# EAGLE design RGB_controller_2zone_v2.00_with_Ard_Nano (EAGLE 8.1.0)
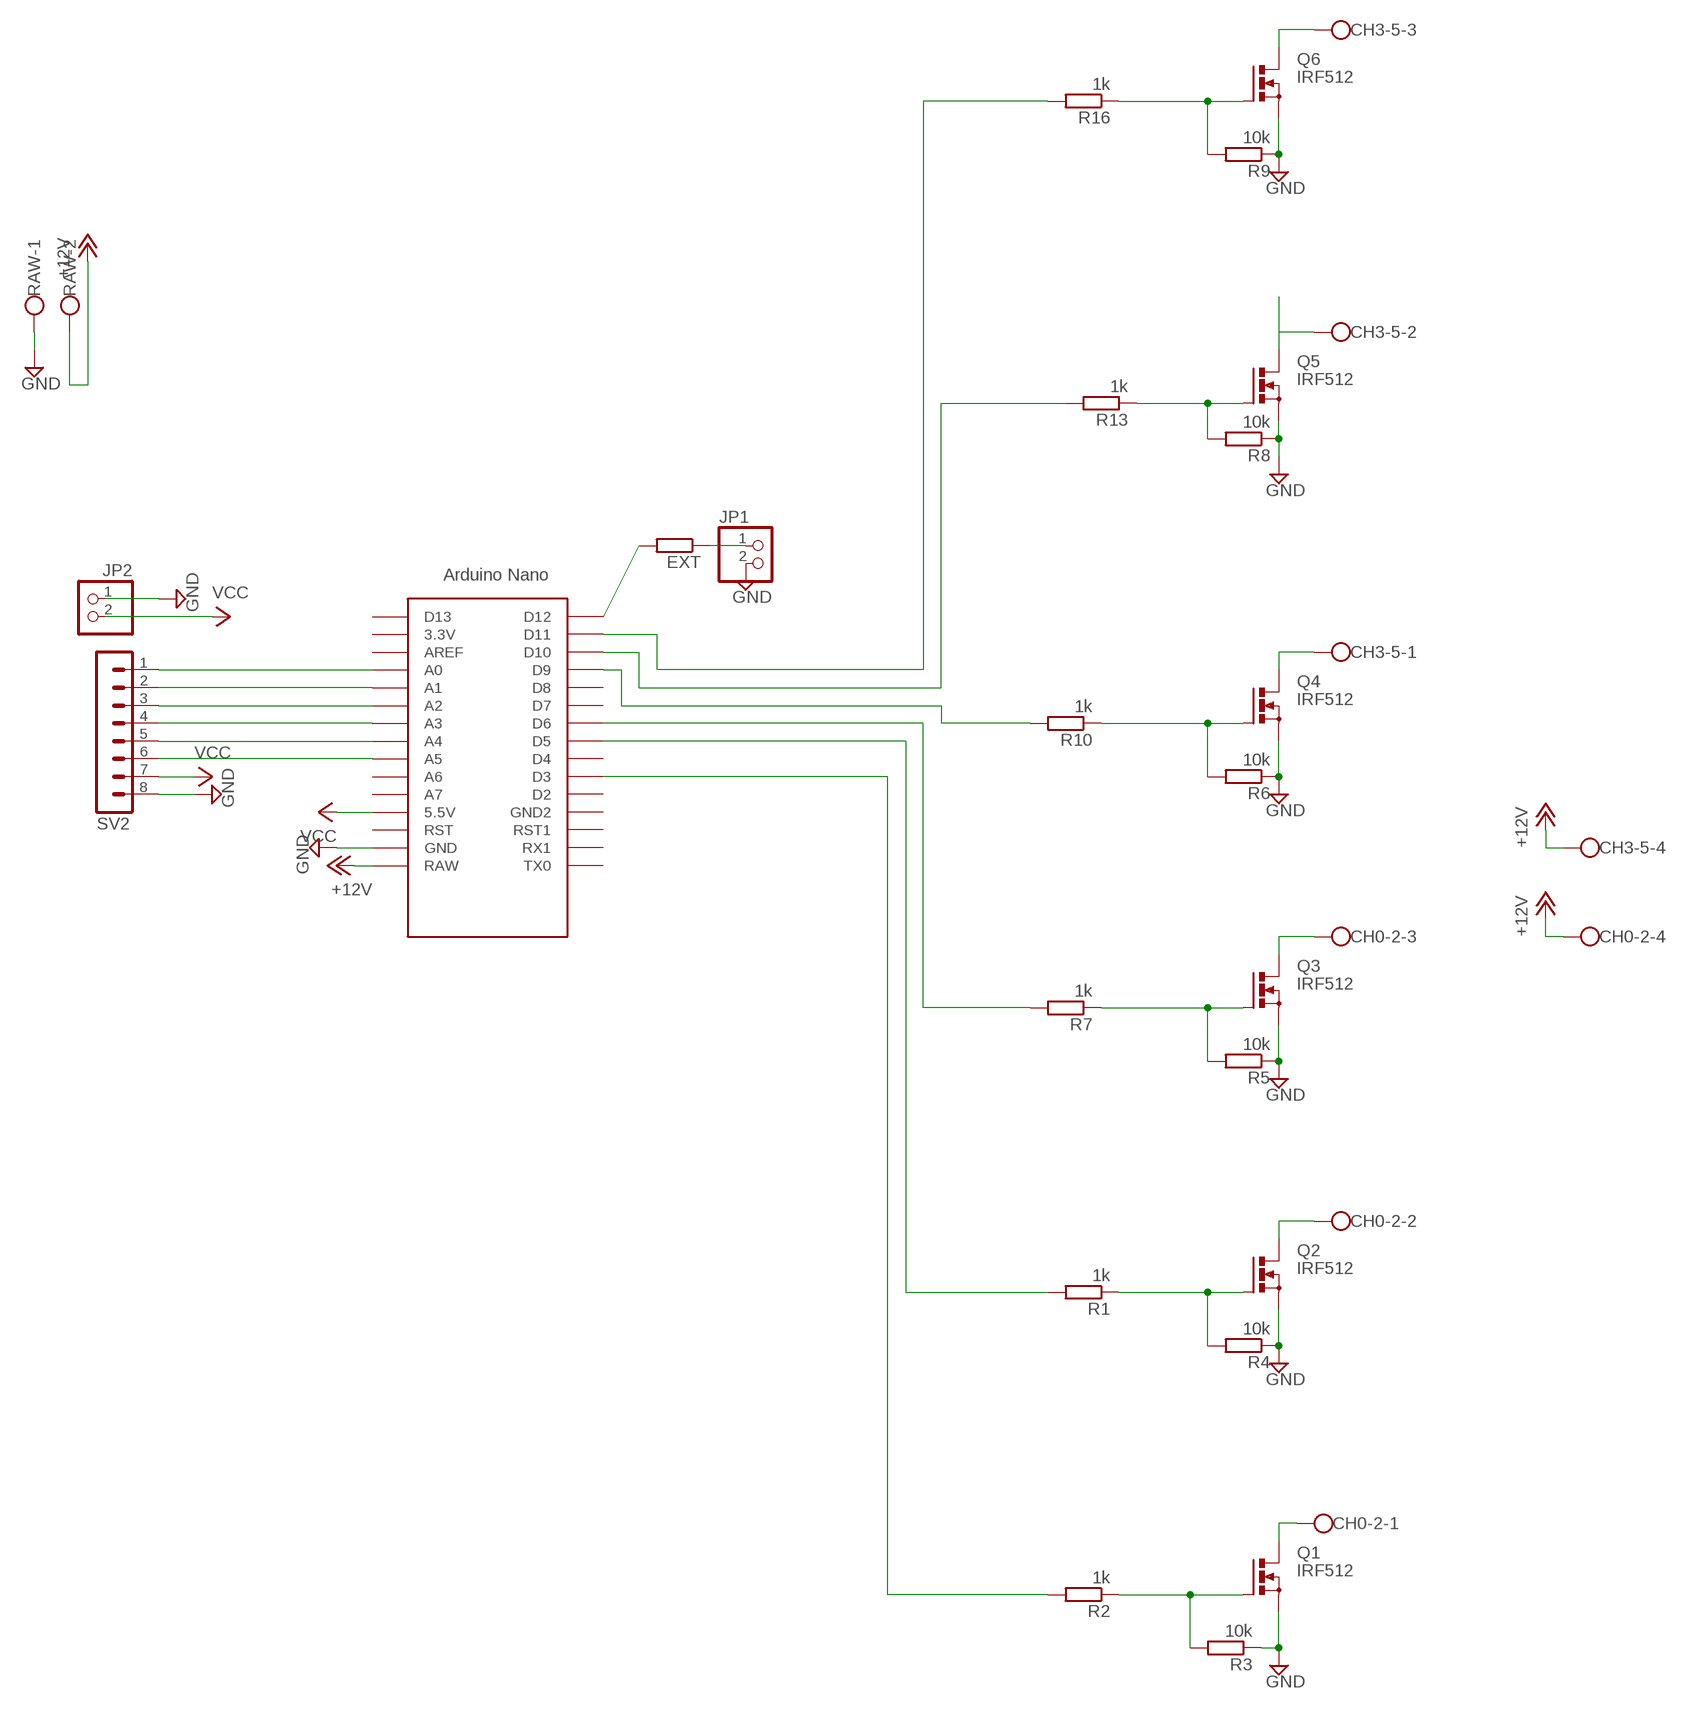
[diagram p0: schematic, sheet 1]

## Parts
CH0-2  W237-4  [W237-4]
CH3-5  W237-4  [W237-4]
EXT  R-EU_0207/10  [0207/10]
JP1  PINHD-1X2  [1X02]
JP2  PINHD-1X2  [1X02]
Q1  IRF512  [TO220BV]
Q2  IRF512  [TO220BV]
Q3  IRF512  [TO220BV]
Q4  IRF512  [TO220BV]
Q5  IRF512  [TO220BV]
Q6  IRF512  [TO220BV]
R1  1k  R-EU_0207/10  [0207/10]
R2  1k  R-EU_0207/10  [0207/10]
R3  10k  R-EU_0207/10  [0207/10]
R4  10k  R-EU_0207/10  [0207/10]
R5  10k  R-EU_0207/10  [0207/10]
R6  10k  R-EU_0207/10  [0207/10]
R7  1k  R-EU_0207/10  [0207/10]
R8  10k  R-EU_0207/10  [0207/10]
R9  10k  R-EU_0207/10  [0207/10]
R10  1k  R-EU_0207/10  [0207/10]
R13  1k  R-EU_0207/10  [0207/10]
R16  1k  R-EU_0207/10  [0207/10]
RAW  W237-102  [W237-102]
SV2  MA08-1  [MA08-1]
U$1  NANO  [NANO]

## Nets
+12V: CH0-2.4 CH3-5.4 RAW.2 U$1.RAW
A0: SV2.1 U$1.A0
A1: SV2.2 U$1.A1
A2: SV2.3 U$1.A2
A3: SV2.4 U$1.A3
A4-D18: SV2.5 U$1.A4
A4-D19: SV2.6 U$1.A5
D12: EXT.2 U$1.D12
GATE_1: Q1.G R2.1 R3.2
GATE_2: Q2.G R1.1 R4.2
GATE_3: Q3.G R5.2 R7.1
GATE_4: Q4.G R6.2 R10.1
GATE_5: Q5.G R8.2 R13.1
GATE_6: Q6.G R9.2 R16.1
GND: JP1.2 JP2.1 Q1.S Q2.S Q3.S Q4.S Q5.S Q6.S R3.1 R4.1 R5.1 R6.1 R8.1 R9.1 RAW.1 SV2.8 U$1.GND
IC_PWM_OUT_0: R2.2 U$1.D3
IC_PWM_OUT_1: R1.2 U$1.D5
IC_PWM_OUT_2: R7.2 U$1.D6
IC_PWM_OUT_3: R10.2 U$1.D9
IC_PWM_OUT_4: R13.2 U$1.D10
IC_PWM_OUT_5: R16.2 U$1.D11
N$2: EXT.1 JP1.1
OUTPUT_0: CH0-2.1 Q1.D
OUTPUT_1: CH0-2.2 Q2.D
OUTPUT_2: CH0-2.3 Q3.D
OUTPUT_3: CH3-5.1 Q4.D
OUTPUT_4: CH3-5.2 Q5.D
OUTPUT_5: CH3-5.3 Q6.D
VCC: JP2.2 SV2.7 U$1.5V(5.5V)
Unconnected: U$1.3.3V U$1.A6 U$1.A7 U$1.AREF U$1.D2 U$1.D4 U$1.D7 U$1.D8 U$1.D13 U$1.GND1(GND2) U$1.ICSP1 U$1.ICSP2 U$1.ICSP3 U$1.ICSP4 U$1.ICSP5 U$1.ICSP6 U$1.RST U$1.RST1 U$1.RX1 U$1.TX0

## Library data of the parts
CH0-2 CH3-5 = con-wago-500:W237-4: WAGO SCREW CLAMP; OC_FARNELL: unknown; OC_NEWARK: unknown
EXT R1-R10 R13 R16 = rcl:R-EU_: RESISTOR, European symbol
JP1 JP2 = pinhead:PINHD-1X2: PIN HEADER
Q1-Q6 = transistor-power:IRF512: N-CHANNEL MOS FET
RAW = con-wago-500:W237-102: WAGO SCREW CLAMP; MPN: 237-102; OC_FARNELL: unknown; OC_NEWARK: 70K9898
SV2 = con-lstb:MA08-1: PIN HEADER; OC_FARNELL: unknown; OC_NEWARK: unknown
U$1 = Arduino-clone:NANO: Arduino Nano

## Board
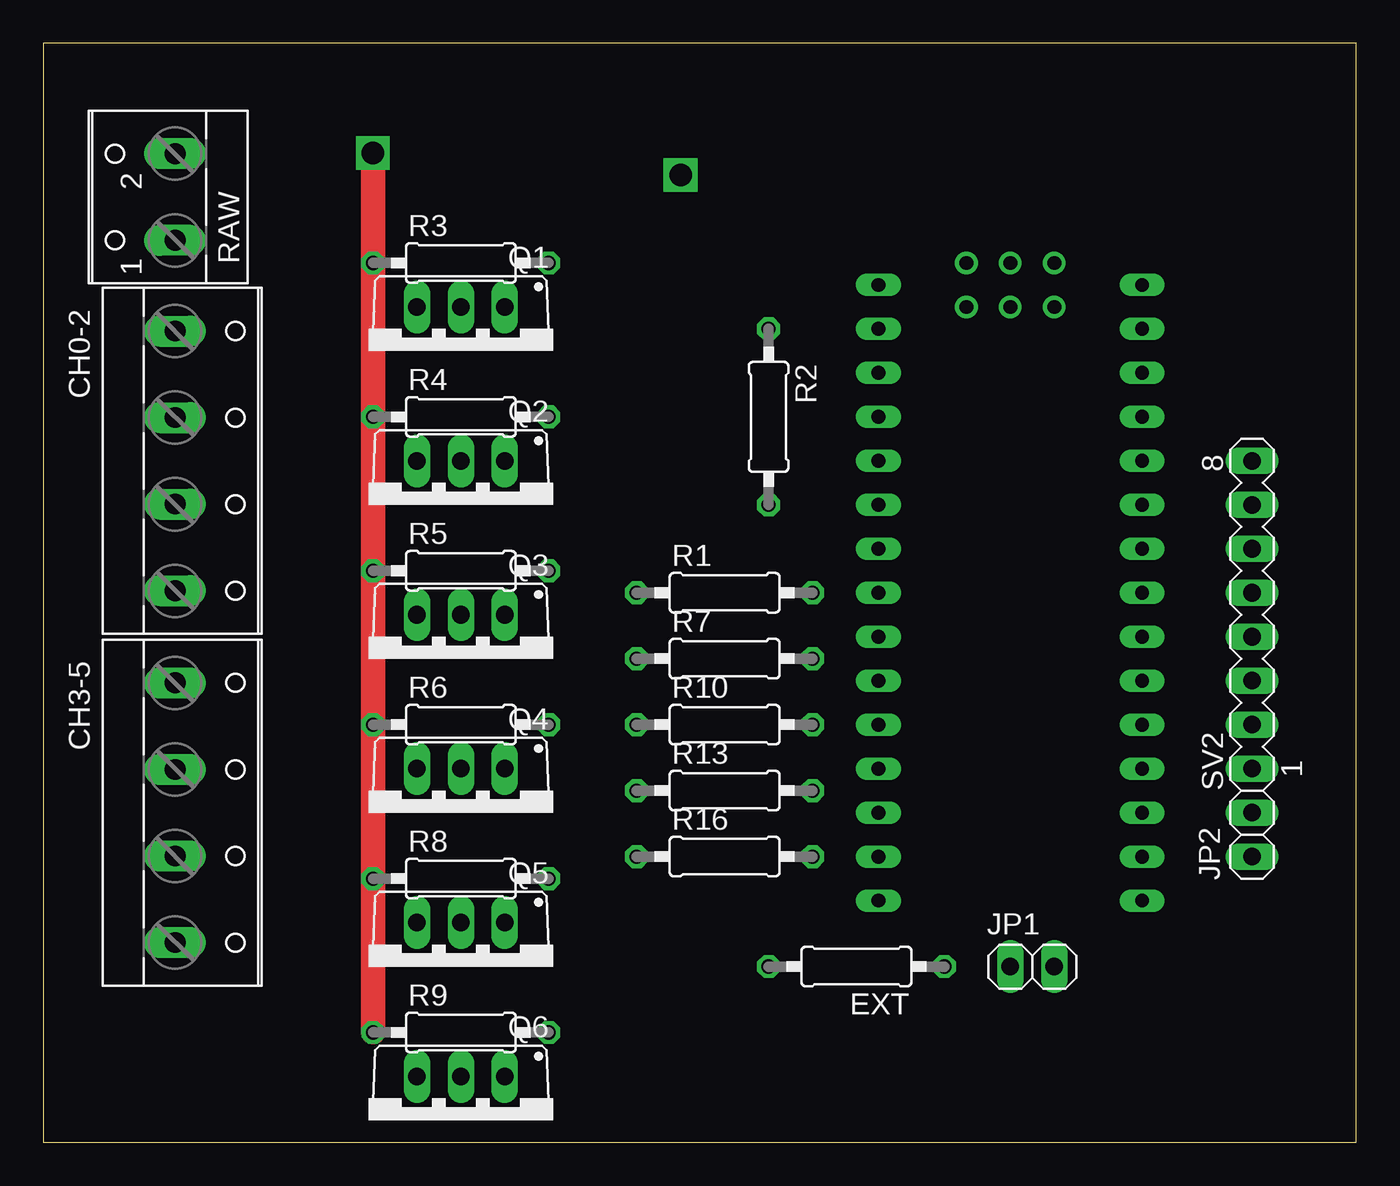
[diagram p1: board, top side]
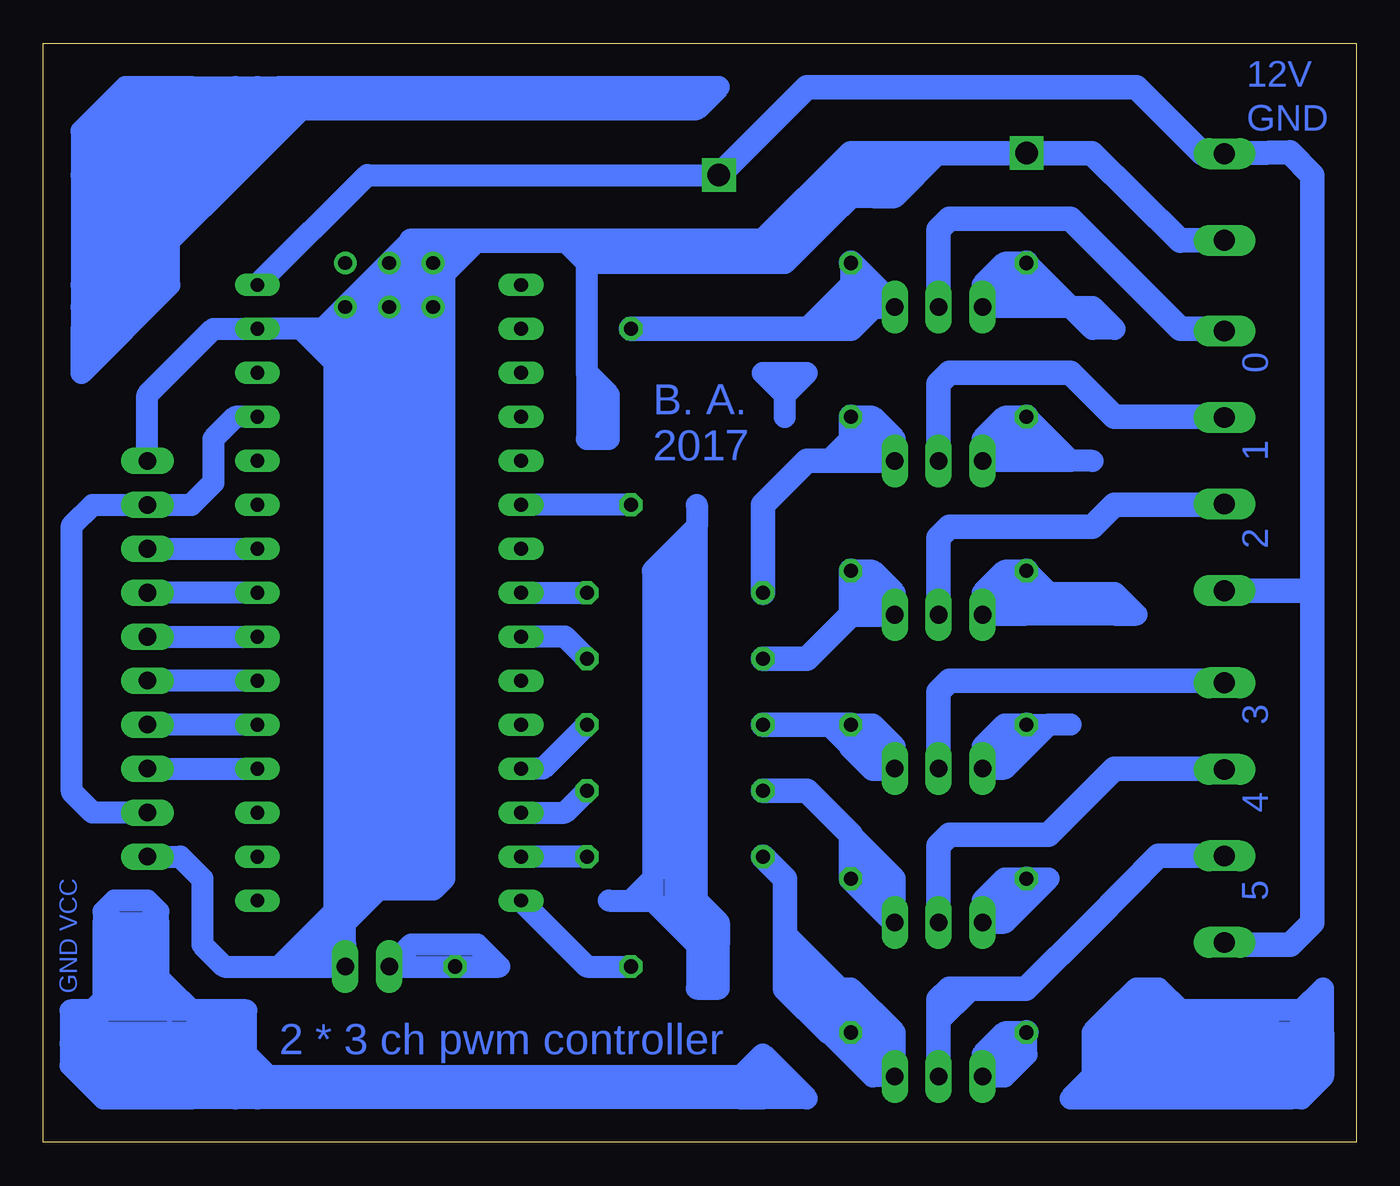
[diagram p2: board, bottom side, seen from below]

Size 75.87 x 63.49 mm. Coordinates in mm from the lower left corner, seen from the top.
Outline: 0,0 75.87,0 75.87,63.49 0,63.49 0,0
Copper layers (1*16): Top 0.035mm / dielectric 1.5mm / Bottom 0.035mm
Design rules "default": minimum track width 10mil, minimum drill 24mil, track to track 8mil, track to pad 8mil, pad to pad 8mil, via to via 8mil, smd to smd 8mil, copper to edge 40mil, drill to drill 8mil, minimum pad ring 10mil, minimum via ring 8mil, stop-mask expansion 4mil, vias tented up to drill 0mil, thermal gap 10mil

### Footprints (pad centres in the part's own frame; a part is rotated, then mirrored left to right if it is on the bottom)
W237-4 = drill 1.194 long: 1 -7.5,-1.27; 2 -2.5,-1.27; 3 2.5,-1.27; 4 7.5,-1.27
0207/10 = drill 0.813 octagon: 1 -5.08,0; 2 5.08,0
1X02 = drill 1.016 long: 1 -1.27,0; 2 1.27,0
TO220BV = drill 1.016 long: D 0,-2.54; G -2.54,-2.54; S 2.54,-2.54
W237-102 = drill 1.194 long: 1 -2.5,-1.27; 2 2.5,-1.27
MA08-1 = drill 1.016 long: 1 -8.89,0; 2 -6.35,0; 3 -3.81,0; 4 -1.27,0; 5 1.27,0; 6 3.81,0; 7 6.35,0; 8 8.89,0
NANO = drill 0.8 long: 3.3V -10.16,24.13; 5V -10.16,-1.27; A0 -10.16,19.05; A1 -10.16,16.51; A2 -10.16,13.97; A3 -10.16,11.43; A4 -10.16,8.89; A5 -10.16,6.35; A6 -10.16,3.81; A7 -10.16,1.27; AREF -10.16,21.59; D2 5.08,1.27; D3 5.08,3.81; D4 5.08,6.35; D5 5.08,8.89; D6 5.08,11.43; D7 5.08,13.97; D8 5.08,16.51; D9 5.08,19.05; D10 5.08,21.59; D11 5.08,24.13; D12 5.08,26.67; D13 -10.16,26.67; GND -10.16,-6.35; GND1 5.08,-1.27; RAW -10.16,-8.89; RST -10.16,-3.81; RST1 5.08,-3.81; RX1 5.08,-6.35; TX0 5.08,-8.89 | drill 0.8: ICSP1 -5.08,-10.16; ICSP2 -5.08,-7.62; ICSP3 -2.54,-10.16; ICSP4 -2.54,-7.62; ICSP5 0,-10.16; ICSP6 0,-7.62

### Placement (x,y rotation side)
CH0-2  8.89,39.37 270 top
CH3-5  8.89,19.05 270 top
EXT  46.99,10.16 180 top
JP1  57.15,10.16 0 top
JP2  69.85,17.78 90 top
Q1  24.13,45.72 180 top
Q2  24.13,36.83 180 top
Q3  24.13,27.94 180 top
Q4  24.13,19.05 180 top
Q5  24.13,10.16 180 top
Q6  24.13,1.27 180 top
R1  39.37,31.75 0 top
R2  41.91,41.91 270 top
R3  24.13,50.8 0 top
R4  24.13,41.91 0 top
R5  24.13,33.02 0 top
R6  24.13,24.13 0 top
R7  39.37,27.94 0 top
R8  24.13,15.24 0 top
R9  24.13,6.35 0 top
R10  39.37,24.13 0 top
R13  39.37,20.32 0 top
R16  39.37,16.51 0 top
RAW  6.35,54.61 90 top
SV2  69.85,30.48 90 top
U$1  53.34,40.64 180 top

### Tracks (layer width: path | path; a pad name or v marks a point on that pad's centre or on a via)
+12V  (via drill 1.3)
  Bottom 1.27: U$1.RAW 57.15,55.88 v36.83,55.88
  Bottom 1.422: 2.54,31.75 2.54,55.88 3.85,57.19 RAW.2 8.89,57.15 12.7,60.96 31.75,60.96 v36.83,55.88 | 2.54,31.75 2.54,12.7 3.81,11.43 7.5,11.43 CH3-5.4 | CH0-2.4 2.66,31.87 2.54,31.75
A0
  Bottom 1.27: SV2.1 U$1.A0
A1
  Bottom 1.27: U$1.A1 SV2.2
A2
  Bottom 1.27: U$1.A2 SV2.3
A3
  Bottom 1.27: SV2.4 U$1.A3
A4-D18
  Bottom 1.27: U$1.A4 SV2.5
A4-D19
  Bottom 1.27: SV2.6 U$1.A5
D12
  Bottom 1.27: U$1.D12 44.45,10.16 EXT.2
GATE_1
  Bottom 1.27: R3.2 29.21,49.53 | 29.21,46.99 29.21,48.26 | 29.21,48.26 27.94,49.53 | 31.75,46.99 29.21,49.53 | 29.21,49.53 29.21,48.26 | 29.21,48.26 30.48,46.99
  Bottom 1.422: R3.2 27.94,49.53 Q1.G 27.94,48.26 29.21,46.99 30.48,46.99 31.75,46.99 R2.1
GATE_2
  Bottom 1.27: R4.2 29.21,39.37 | R4.2 27.94,41.91 26.67,40.64 Q2.G R4.2 | 29.21,40.64 30.48,39.37
  Bottom 1.422: R4.2 29.21,40.64 27.94,39.37 | 27.94,39.37 Q2.G | R1.1 34.29,36.83 31.75,39.37 30.48,39.37 29.21,39.37 27.94,39.37
GATE_3
  Bottom 1.27: Q3.G 26.67,31.75 | 26.67,31.75 27.94,33.02 R5.2 27.94,31.75 | 29.21,31.75 27.94,31.75 | 26.67,31.75 27.94,31.75
  Bottom 1.422: R7.1 31.75,27.94 29.21,30.48 | 29.21,30.48 Q3.G | R5.2 29.21,31.75 29.21,30.48
GATE_4
  Bottom 1.27: 29.21,22.86 30.48,24.13 | Q4.G 26.67,22.86 27.94,24.13 R6.2 Q4.G
  Bottom 1.422: R10.1 30.48,24.13 R6.2 29.21,22.86 27.94,21.59 Q4.G
GATE_5
  Bottom 1.27: Q5.G 26.67,13.97 | 26.67,13.97 26.67,15.24 29.21,17.78 29.21,16.51 26.67,13.97
  Bottom 1.422: R13.1 31.75,20.32 29.21,17.78 R8.2 Q5.G
GATE_6
  Bottom 1.27: 30.48,6.35 27.94,3.81 Q6.G 26.67,4.45 | 27.94,5.08 31.75,8.89 | 31.75,8.89 33.02,10.16 | 27.3,4.45 26.67,4.45 | 26.67,4.45 26.67,5.71 | 26.67,5.71 26.67,6.35 29.21,8.89 29.84,8.89 | 31.75,8.89 30.48,8.89 | 29.84,8.89 26.67,5.71 | 26.67,5.71 27.3,5.71 30.48,8.89 | 29.84,8.89 33.02,12.06 | 29.84,8.89 30.48,8.89 | 30.48,8.89 32.38,10.79
  Bottom 1.422: Q6.G 27.3,4.45 27.94,5.08 R9.2 30.48,6.35 33.02,8.89 33.02,10.16 33.02,12.06 33.02,15.24 R16.1
GND  (via drill 1.3)
  Top 1.422: R9.1 R8.1 R6.1 R5.1 R4.1 R3.1 v19.05,57.15
  Bottom 1.27: SV2.8 69.85,43.18 66.04,46.99 U$1.GND 60.96,46.99 | 55.88,46.99 57.15,46.99 | 58.42,46.99 59.69,46.99 | 59.69,46.99 60.96,46.99 | 55.88,46.99 55.88,50.8 | 55.88,50.8 54.61,52.07 | 58.42,11.43 JP1.2 59.69,10.16 | 58.42,11.43 58.42,12.7 | 58.42,12.7 58.42,13.97 | 58.42,13.97 57.15,15.24 | 57.15,15.24 55.88,16.51 | 55.88,16.51 55.88,46.99 | R3.1 20.32,50.8 21.59,49.53 Q1.S 20.32,48.26 | 20.32,48.26 R3.1 | R3.1 19.05,49.53 20.32,48.26 | R4.1 20.32,41.91 21.59,40.64 Q2.S 20.32,39.37 | 20.32,39.37 19.05,40.64 | 20.32,30.48 Q3.S 21.59,31.75 20.32,33.02 R5.1 | 20.32,30.48 19.05,31.75 R5.1 | 19.05,22.86 20.32,21.59 Q4.S 21.59,22.86 20.32,24.13 R6.1 | 19.05,22.86 R6.1 | 19.05,13.97 20.32,12.7 Q5.S 21.59,13.97 20.32,15.24 R8.1 | 19.05,13.97 R8.1 | 56.52,14.61 54.61,16.51 53.34,16.51 | 53.34,16.51 53.34,49.53 52.7,50.16 | 52.7,50.16 52.07,50.8 | 52.07,50.8 50.8,52.07 52.07,52.07 54.61,49.53 | 54.61,49.53 54.61,50.8 | 54.61,52.07 53.34,52.07 52.07,50.8 | 52.07,50.8 54.61,50.8 | 59.69,46.99 55.88,50.8 | 54.61,52.07 54.61,50.8 | 54.61,50.8 58.42,46.99 | 58.42,46.99 57.15,46.99 | 57.15,46.99 54.61,49.53 | 54.61,49.53 54.61,46.99 | 58.42,15.24 57.15,13.97 | 57.15,13.97 58.42,13.97 | 58.42,13.97 58.42,15.24 | 58.42,15.24 58.42,16.51 | 58.42,16.51 57.15,16.51 | 55.88,16.51 57.15,16.51 | 57.15,16.51 58.42,15.24 | 58.42,16.51 58.42,46.99 | 57.15,13.97 58.42,12.7 | R5.1 17.78,31.75 | 17.78,31.75 13.97,31.75 | 13.97,31.75 13.97,30.48 | 13.97,30.48 19.05,30.48 | 20.32,30.48 19.05,30.48 | 19.05,30.48 17.78,31.75 | 20.32,48.26 19.05,48.26 | 19.05,48.26 16.51,48.26 | 16.51,48.26 17.78,49.53 | 17.78,49.53 R3.1 | R3.1 19.05,48.26 | 19.05,48.26 17.78,49.53 | 20.32,39.37 17.78,39.37
  Bottom 1.27: 17.78,39.37 16.51,39.37 | 16.51,39.37 R4.1 | R4.1 19.05,40.64 | 19.05,40.64 17.78,39.37 | R6.1 17.78,24.13 | 16.51,24.13 17.78,24.13 | 17.78,24.13 19.05,22.86 | 19.05,13.97 17.78,15.24 R8.1 | JP2.1 67.94,16.51 66.67,15.24 66.67,11.43 65.41,10.16 62.23,10.16 | 62.23,10.16 60.96,10.16 | 62.23,10.16 59.05,13.34 | 59.05,13.34 58.42,13.97 | 57.15,15.24 57.15,13.97 | 58.42,12.7 60.96,10.16 | 60.96,10.16 59.69,10.16 | 59.69,10.16 58.42,11.43 | 44.45,44.45 43.18,43.18 43.18,40.64 44.45,40.64 44.45,44.45 | 44.45,44.45 44.45,50.8 | 44.45,50.8 45.72,52.07 | 43.18,52.07 44.45,50.8 | 44.45,50.8 35.56,50.8 | 34.29,52.07 35.56,50.8 | 35.56,50.8 34.29,50.8 | 34.29,50.8 33.02,50.8 | 33.02,50.8 33.02,52.07 | 33.02,52.07 31.75,53.34 | 34.29,50.8 33.02,52.07 | 31.75,53.34 30.48,53.34 | 30.48,53.34 29.21,54.61 | 27.94,54.61 26.67,54.61 24.13,57.15 25.4,57.15 27.94,54.61 | 27.94,54.61 29.21,54.61 | 29.21,54.61 26.67,57.15 27.94,57.15 31.75,53.34 | 33.02,50.8 30.48,53.34 | 13.97,30.48 12.7,30.48 13.97,31.75 | 15.24,39.37 16.51,39.37 | 16.51,48.26 15.24,48.26 13.97,46.99 15.24,46.99 16.51,48.26 | 53.34,16.51 53.34,15.88 54.61,14.61 | 54.61,14.61 55.24,14.61 56.52,14.61 | 57.15,13.97 56.52,14.61 | 56.52,14.61 53.98,15.88 | 59.69,46.99 59.05,46.35 | 57.78,45.09 59.05,46.35 | 59.05,46.35 59.05,45.09 | 59.05,45.09 59.05,13.34 | 60.96,46.99 59.05,45.09 | 52.7,50.16 52.7,15.24 53.34,14.61 54.61,14.61 | Q6.S 20.32,3.81 19.05,5.08 R9.1 20.32,6.35 21.59,5.08 Q6.S
  Bottom 1.422: Q1.S R3.1 | Q4.S R6.1 | Q5.S R8.1 | Q6.S R9.1 | Q3.S R5.1 | Q2.S R4.1 | RAW.1 10.16,52.11 10.16,52.07 15.28,57.15 v19.05,57.15 24.13,57.15 26.67,57.15 29.21,57.15 34.29,52.07 43.18,52.07 45.72,52.07 50.8,52.07 54.61,52.07
IC_PWM_OUT_0
  Bottom 1.27: R2.2 U$1.D3
IC_PWM_OUT_1
  Bottom 1.27: U$1.D5 R1.2
IC_PWM_OUT_2
  Bottom 1.27: R7.2 45.72,29.21 U$1.D6
IC_PWM_OUT_3
  Bottom 1.27: R10.2 46.99,21.59 U$1.D9
IC_PWM_OUT_4
  Bottom 1.27: U$1.D10 45.72,19.05 R13.2
IC_PWM_OUT_5
  Bottom 1.27: R16.2 U$1.D11
N$2
  Bottom 1.27: JP1.1 EXT.1 49.53,10.16 50.8,11.43 54.61,11.43 JP1.1
N$3
  Bottom 1.27: 33.02,44.45 33.02,43.18 | 33.02,41.91 33.02,43.18 | 33.02,43.18 34.29,44.45 33.02,44.45 | 33.02,44.45 31.75,44.45 33.02,43.18
N$6
  Bottom 1.27: 70.48,60.33 73.03,57.78
OUTPUT_0
  Bottom 1.422: Q1.D 24.13,52.7 23.5,53.34 16.51,53.34 10.16,46.99 7.74,46.99 CH0-2.1
OUTPUT_1
  Bottom 1.422: Q2.D 24.13,43.81 23.5,44.45 16.51,44.45 13.97,41.91 7.66,41.91 CH0-2.2
OUTPUT_2
  Bottom 1.422: Q3.D 24.13,34.92 23.5,35.56 15.24,35.56 13.97,36.83 7.66,36.83 CH0-2.3
OUTPUT_3
  Bottom 1.422: Q4.D 24.13,26.04 23.5,26.67 7.74,26.67 CH3-5.1
OUTPUT_4
  Bottom 1.422: Q5.D 24.13,17.14 23.5,17.78 17.78,17.78 13.97,21.59 7.66,21.59 CH3-5.2
OUTPUT_5
  Bottom 1.27: 24.13,6.99 22.23,8.89
  Bottom 1.422: Q6.D 24.13,6.99 24.13,8.26 23.5,8.89 22.23,8.89 19.09,8.89 15.24,12.7 11.43,16.55 CH3-5.3
PH1
  Bottom 1.27: 34.29,5.08 33.02,3.81 | 33.02,3.81 31.75,2.54 34.29,2.54 | 35.56,2.54 63.5,2.54 | 63.5,2.54 64.77,2.54 | 64.77,2.54 67.31,2.54 | 64.77,3.81 63.5,2.54 | 34.29,5.08 34.29,3.81 35.56,2.54 | 35.56,2.54 34.29,2.54 | 34.29,2.54 33.02,3.81 | 34.29,5.08 35.56,3.81 62.87,3.81 | 62.87,3.81 64.77,3.81 | 64.77,5.08 67.31,5.08 | 67.31,5.08 68.58,5.08 | 68.58,5.08 69.85,5.08 | 69.85,5.08 73.66,5.08 | 68.58,2.54 73.66,5.08 | 64.77,5.08 64.77,5.71 | 64.77,5.71 64.77,6.99 | 64.77,6.99 64.77,7.62 | 67.31,7.62 68.58,7.62 | 68.58,7.62 72.39,7.62 | 72.39,7.62 73.66,6.35 | 73.66,6.35 73.66,5.08 | 73.66,5.08 71.12,2.54 | 71.12,2.54 68.58,2.54 | 64.77,2.54 64.77,3.81 | 64.77,7.62 67.31,7.62 | 67.31,7.62 66.04,6.35 | 66.04,5.08 66.04,3.81 | 66.04,3.81 64.77,2.54 | 64.77,3.81 64.77,5.08 | 64.77,5.08 66.04,6.35 | 66.04,6.35 66.04,5.08 | 66.04,5.08 64.77,3.81 | 72.39,7.62 72.39,8.26 | 72.39,8.26 72.39,12.7 | 72.39,12.7 69.22,12.7 | 69.22,12.7 69.22,9.53 68.58,8.89 | 67.31,7.62 68.58,8.89 | 68.58,8.89 68.58,7.62 | 72.39,6.35 66.04,6.35 | 73.66,6.35 72.39,6.35 | 72.39,6.35 68.58,2.54 | 68.58,2.54 67.31,2.54 | 67.31,2.54 66.04,3.81 | 66.04,3.81 67.31,5.08 | 67.31,5.08 67.31,3.81 | 67.31,3.81 68.58,5.08 | 68.58,5.08 68.58,2.54 | 68.58,2.54 67.31,3.81 | 67.31,3.81 68.58,3.81 69.85,5.08 | 72.39,7.62 73.03,7.62 | 73.03,7.62 73.66,7.62 | 73.66,7.62 73.66,6.99 | 73.66,6.35 73.66,6.99 | 73.66,6.99 74.3,7.62 | 73.66,7.62 74.3,7.62 | 74.3,7.62 74.3,5.71 | 74.3,5.71 73.66,5.08 | 74.3,5.71 74.3,4.45 72.39,2.54 71.12,2.54 | 64.77,5.71 64.14,5.08 | 62.87,3.81 64.14,5.08 | 64.14,5.08 64.14,7.62 64.77,7.62 | 64.77,6.99 66.04,6.99 | 69.22,12.7 69.22,13.34 69.85,13.97 71.75,13.97 72.39,13.34 72.39,12.7 | 72.39,8.26 73.03,7.62
PH2
  Bottom 1.27: 43.18,13.97 41.91,13.97 | 40.64,13.97 39.37,12.7 | 39.37,12.7 38.1,11.43 38.1,8.89 36.83,8.89 36.83,11.43 | 36.83,12.7 38.1,13.97 38.1,35.56 | 38.1,36.83 38.1,35.56 | 38.1,35.56 39.37,34.29 | 40.64,15.24 40.64,33.02 39.37,34.29 | 40.64,15.24 41.91,13.97 | 41.91,13.97 40.64,13.97 | 40.64,13.97 40.64,15.24 | 39.37,34.29 39.37,13.97 | 39.37,13.97 39.37,12.7 | 39.37,12.7 36.83,12.7 | 36.83,12.7 36.83,11.43 | 36.83,11.43 39.37,13.97
PH3
  Bottom 1.27: 67.31,60.96 68.58,60.96 | 68.58,60.96 71.12,60.96 73.66,58.42 73.66,55.88 | 73.66,55.88 73.66,49.53 | 68.58,49.53 73.66,44.45 73.66,45.72 | 68.58,49.53 68.58,52.07 | 68.58,52.07 64.77,55.88 | 64.77,55.88 60.96,59.69 | 60.96,59.69 38.1,59.69 36.83,60.96 62.23,60.96 | 67.31,60.96 68.58,59.69 | 68.58,59.69 72.39,55.88 73.66,55.88 | 73.66,55.88 68.58,60.96 | 67.31,60.96 64.77,60.96 | 63.5,60.96 62.23,60.96 | 62.23,60.96 60.96,59.69 | 60.96,59.69 62.23,59.69 | 62.23,59.69 64.77,57.15 | 64.77,59.69 64.77,60.96 | 64.77,60.96 63.5,60.96 | 63.5,60.96 62.23,59.69 | 62.23,59.69 63.5,59.69 64.77,58.42 | 64.77,58.42 64.77,59.69 | 64.77,59.69 63.5,60.96 | 64.77,57.15 64.77,55.88 | 69.85,49.53 71.12,49.53 | 72.39,49.53 73.66,49.53 | 73.66,49.53 73.66,48.26 | 73.66,48.26 73.66,46.99 | 73.66,45.72 73.66,46.99 | 73.66,46.99 71.12,49.53 | 71.12,49.53 72.39,49.53 | 72.39,49.53 73.66,48.26 | 73.66,48.26 71.12,48.26 | 71.12,48.26 73.66,45.72 | 71.12,48.26 69.85,49.53 | 69.85,49.53 68.58,49.53 | 64.77,59.69 66.04,59.69 | 67.31,59.69 68.58,59.69 | 68.58,59.69 68.58,58.42 | 68.58,58.42 68.58,57.15 | 68.58,57.15 68.58,55.88 | 68.58,54.61 68.58,53.34 | 68.58,52.07 68.58,53.34 | 68.58,53.34 64.77,57.15 | 64.77,57.15 64.77,58.42 | 64.77,58.42 66.04,59.69 | 66.04,59.69 67.31,59.69 | 67.31,59.69 68.58,58.42 | 68.58,58.42 67.31,58.42 | 66.04,58.42 64.77,58.42 | 64.77,58.42 68.58,54.61 | 68.58,54.61 68.58,55.88 | 68.58,55.88 66.04,58.42 | 66.04,58.42 67.31,58.42 | 67.31,58.42 68.58,57.15
PH4
  Bottom 1.27: 15.24,2.54 5.08,2.54 | 5.08,2.54 1.91,6.35 | 1.91,6.35 1.91,7.62 | 1.91,7.62 1.91,8.89 3.17,7.62 | 3.17,7.62 5.08,7.62 | 5.08,7.62 10.16,7.62 | 10.16,7.62 11.43,8.89 12.7,8.89 13.97,7.62 | 13.97,7.62 15.24,6.35 15.24,3.81 16.51,2.54 15.24,2.54 | 15.24,2.54 13.97,3.81 | 13.97,7.62 13.97,3.81 | 6.35,3.81 5.08,3.81 3.17,6.35 | 3.17,6.35 1.91,7.62 | 1.91,7.62 3.17,7.62 | 10.16,7.62 13.97,7.62 | 13.97,3.81 6.35,3.81 | 6.35,3.81 5.08,5.08 | 5.08,5.08 5.08,6.35 | 5.08,6.35 3.81,6.35 | 3.17,6.35 3.81,6.35 | 3.81,6.35 5.08,5.08 | 5.08,6.35 5.08,7.62 | 1.91,6.35 1.91,3.81 3.17,2.54 3.81,2.54 | 5.08,2.54 3.81,2.54 | 3.81,2.54 2.54,4.45
VCC
  Bottom 1.27: U$1.5V 64.77,41.91 66.04,40.64 66.04,38.1 67.31,36.83 SV2.7 73.03,36.83 74.22,35.64 74.22,20.24 73.03,19.05 JP2.2
(copper drawn outside any net)
  shapes: Bottom area x9

### Text on the board
Bottom: 12V | GND | 0 | 1 | B. A. / 2017 | 2 | 3 | 4 | GND VCC | 5 | 2 * 3 ch pwm controller